# EAGLE design TESTED_Midi2PO_V3 (EAGLE 9.6.2)
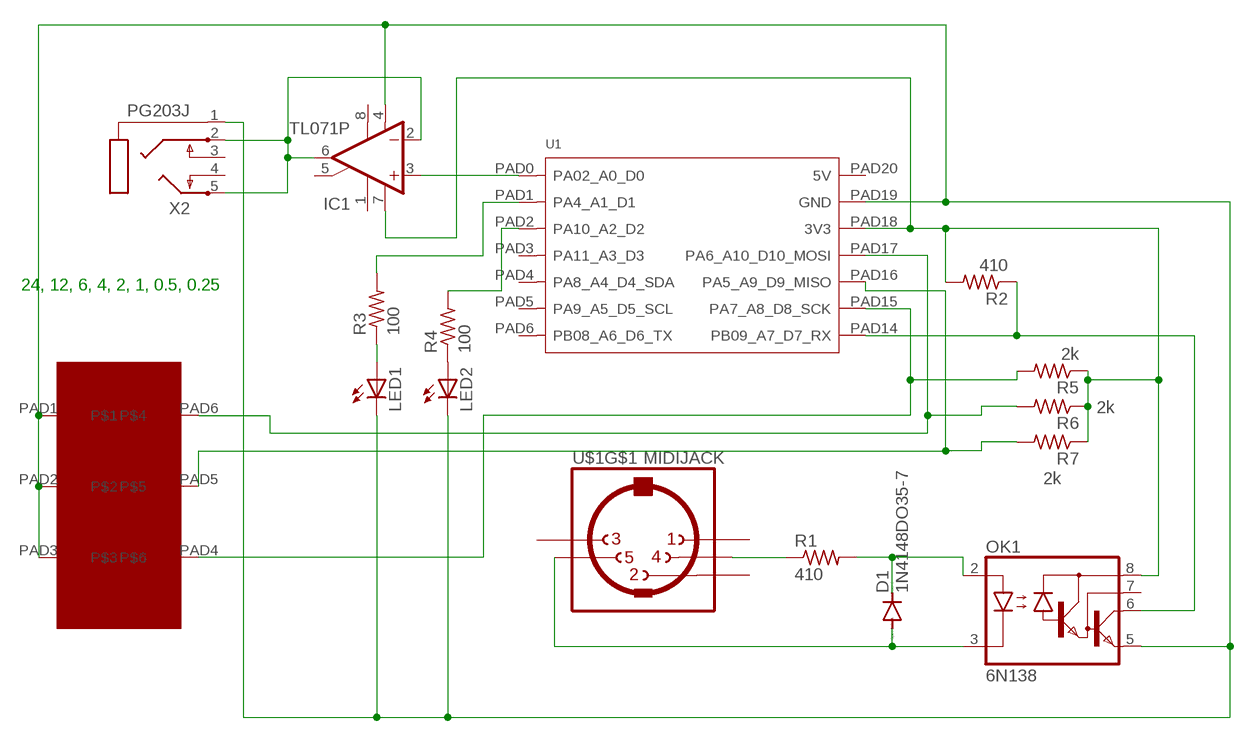
[diagram p0: schematic, sheet 1]

## Parts
D1  1N4148DO35-7  [DO35-7]
IC1  TL071P  [DIL08]
LED1  LED5MM  [LED5MM]
LED2  LED5MM  [LED5MM]
OK1  6N138  [DIL08]
R1  410  R-US_0207/9  [0207/9]
R2  410  R-US_0207/9  [0207/9]
R3  100  R-US_0207/9  [0207/9]
R4  100  R-US_0207/9  [0207/9]
R5  2k  R-US_0207/9  [0207/9]
R6  2k  R-US_0207/9  [0207/9]
R7  2k  R-US_0207/9  [0207/9]
U1  MOUDLE-SEEEDUINO-XIAO  [MOUDLE14P-2.54-21X17.8MM]
U$1  MIDIJACK  [CP-2350]
U$2  MCNDA-03V  [MCNDA-03V]
X2  PG203J  [PG203J]

## Nets
N$1: D1.C OK1.2(A) R1.2
N$2: R1.1 U$1.4
N$3: D1.A OK1.3(C) U$1.5
N$4: IC1.4(V-) LED1.K(C) LED2.K(C) OK1.5(GND) U1.PAD19(GND) U$2.PAD1 U$2.PAD2 U$2.PAD3 X2.1
N$5: OK1.6(VO) R2.1 U1.PAD14(PB09_A7_D7_RX)
N$6: R6.2 U1.PAD17(PA6_A10_D10_MOSI) U$2.PAD6
N$7: IC1.3(+IN) U1.PAD0(PA02_A0_D0)
N$8: LED1.A R3.1
N$9: R3.2 U1.PAD1(PA4_A1_D1)
N$11: IC1.2(-IN) IC1.6(OUT) X2.2 X2.5
N$12: LED2.A R4.1
N$13: R4.2 U1.PAD2(PA10_A2_D2)
N$14: R7.2 U1.PAD16(PA5_A9_D9_MISO) U$2.PAD5
N$15: R5.2 U1.PAD15(PA7_A8_D8_SCK) U$2.PAD4
N$16: IC1.7(V+) OK1.8(VCC) R2.2 R5.1 R6.1 R7.1 U1.PAD18(3V3)
Unconnected: IC1.1(ON1) IC1.5(ON2) IC1.8(OPT) OK1.7(VB) U1.PAD3(PA11_A3_D3) U1.PAD4(PA8_A4_D4_SDA) U1.PAD5(PA9_A5_D5_SCL) U1.PAD6(PB08_A6_D6_TX) U1.PAD20(5V) U$1.1 U$1.2 U$1.3 U$1.PE1(MT) U$1.PE2(MT) U$1.PE(MT) U$1.PE@(MT) X2.3 X2.4

## Notes on the sheet
- 24, 12, 6, 4, 2, 1, 0.5, 0.25

## Library data of the parts
D1 = diode:1N4148: DIODE high speed (Philips)
IC1 = linear:TL071: OP AMP
LED1 = adafruit:LED: LED OSRAM: - CHIPLED LG R971, LG N971, LY N971, LG Q971, LY Q971, LO R971, LY R971 LH N974, LH R974 LS Q976, LO Q976, LY Q976 LO Q996 - Hyper CHIPLED LW Q18S LB Q993, LB Q99A, LB R99A - SideLED LS A670, LO A670, LY A670, LG A670, LP A670 LB A673, LV A673, LT A673, LW A673 LH A674 LY A675 LS A676, LA A676, LO A676, LY A676, LW A676 LS A679, LY A679, LG A679 - Hyper Micro SIDELED® LS Y876, LA Y876, LO Y876, LY Y876 LT Y87S - SmartLED LW L88C, LW L88S LB L89C, LB L89S, LG L890 LS L89K, LO L89K, LY L89K LS L896, LA L896, LO L896, LY L896 - TOPLED LS T670, LO T670, LY T670, LG T670, LP T670 LSG T670, LSP T670, LSY T670, LOP T670, LYG T670 LG T671, LOG T671, LSG T671 LB T673, LV T673, LT T673, LW T673 LH T674 LS T676, LA T676, LO T676, LY T676, LB T676, LH T676, LSB T676, LW T676 LB T67C, LV T67C, LT T67C, LS T67K, LO T67K, LY T67K, LW E67C LS E67B, LA E67B, LO E67B, LY E67B, LB E67C, LV E67C, LT E67C LW T67C LS T679, LY T679, LG T679 LS T770, LO T770, LY T770, LG T770, LP T770 LB T773, LV T773, LT T773, LW T773 LH T774 LS E675, LA E675, LY E675, LS T675 LS T776, LA T776, LO T776, LY T776, LB T776 LHGB T686 LT T68C, LB T68C - Hyper Mini TOPLED® LB M676 - Mini TOPLED Santana® LG M470 LS M47K, LO M47K, LY M47K Source: http://www.osram.convergy.de/; SPICEPREFIX: L
LED2 = adafruit:LED: LED OSRAM: - CHIPLED LG R971, LG N971, LY N971, LG Q971, LY Q971, LO R971, LY R971 LH N974, LH R974 LS Q976, LO Q976, LY Q976 LO Q996 - Hyper CHIPLED LW Q18S LB Q993, LB Q99A, LB R99A - SideLED LS A670, LO A670, LY A670, LG A670, LP A670 LB A673, LV A673, LT A673, LW A673 LH A674 LY A675 LS A676, LA A676, LO A676, LY A676, LW A676 LS A679, LY A679, LG A679 - Hyper Micro SIDELED® LS Y876, LA Y876, LO Y876, LY Y876 LT Y87S - SmartLED LW L88C, LW L88S LB L89C, LB L89S, LG L890 LS L89K, LO L89K, LY L89K LS L896, LA L896, LO L896, LY L896 - TOPLED LS T670, LO T670, LY T670, LG T670, LP T670 LSG T670, LSP T670, LSY T670, LOP T670, LYG T670 LG T671, LOG T671, LSG T671 LB T673, LV T673, LT T673, LW T673 LH T674 LS T676, LA T676, LO T676, LY T676, LB T676, LH T676, LSB T676, LW T676 LB T67C, LV T67C, LT T67C, LS T67K, LO T67K, LY T67K, LW E67C LS E67B, LA E67B, LO E67B, LY E67B, LB E67C, LV E67C, LT E67C LW T67C LS T679, LY T679, LG T679 LS T770, LO T770, LY T770, LG T770, LP T770 LB T773, LV T773, LT T773, LW T773 LH T774 LS E675, LA E675, LY E675, LS T675 LS T776, LA T776, LO T776, LY T776, LB T776 LHGB T686 LT T68C, LB T68C - Hyper Mini TOPLED® LB M676 - Mini TOPLED Santana® LG M470 LS M47K, LO M47K, LY M47K Source: http://www.osram.convergy.de/
OK1 = optocoupler:6N138: MOTOROLA OPTO COUPLER; MF: VISHAY/TELEFUNKEN; MPN: 6N138; OC_FARNELL: 9860150; OC_NEWARK: 35K5294
R1 R2 R4-R7 = adafruit:R-US_: RESISTOR, American symbol
R3 = adafruit:R-US_: RESISTOR, American symbol; SPICEPREFIX: R
U1 = Seeeduino XIAO_holes:MOUDLE-SEEEDUINO-XIAO
U$1 = adafruit:MIDIJACK: DIN 5 jack also known as MIDI jack A modification of conn-hirshman:MAB5SH with two options for the grounding 'teeth'
U$2 = Vertical_DIP3_Sw:MCNDA-03V
X2 = con-hirschmann:PG203J: MIC/HEADPHONE JACK KS-S stereo microphone/headphone jack PG203JN (Schukat); OC_FARNELL: unknown; OC_NEWARK: unknown

## Board
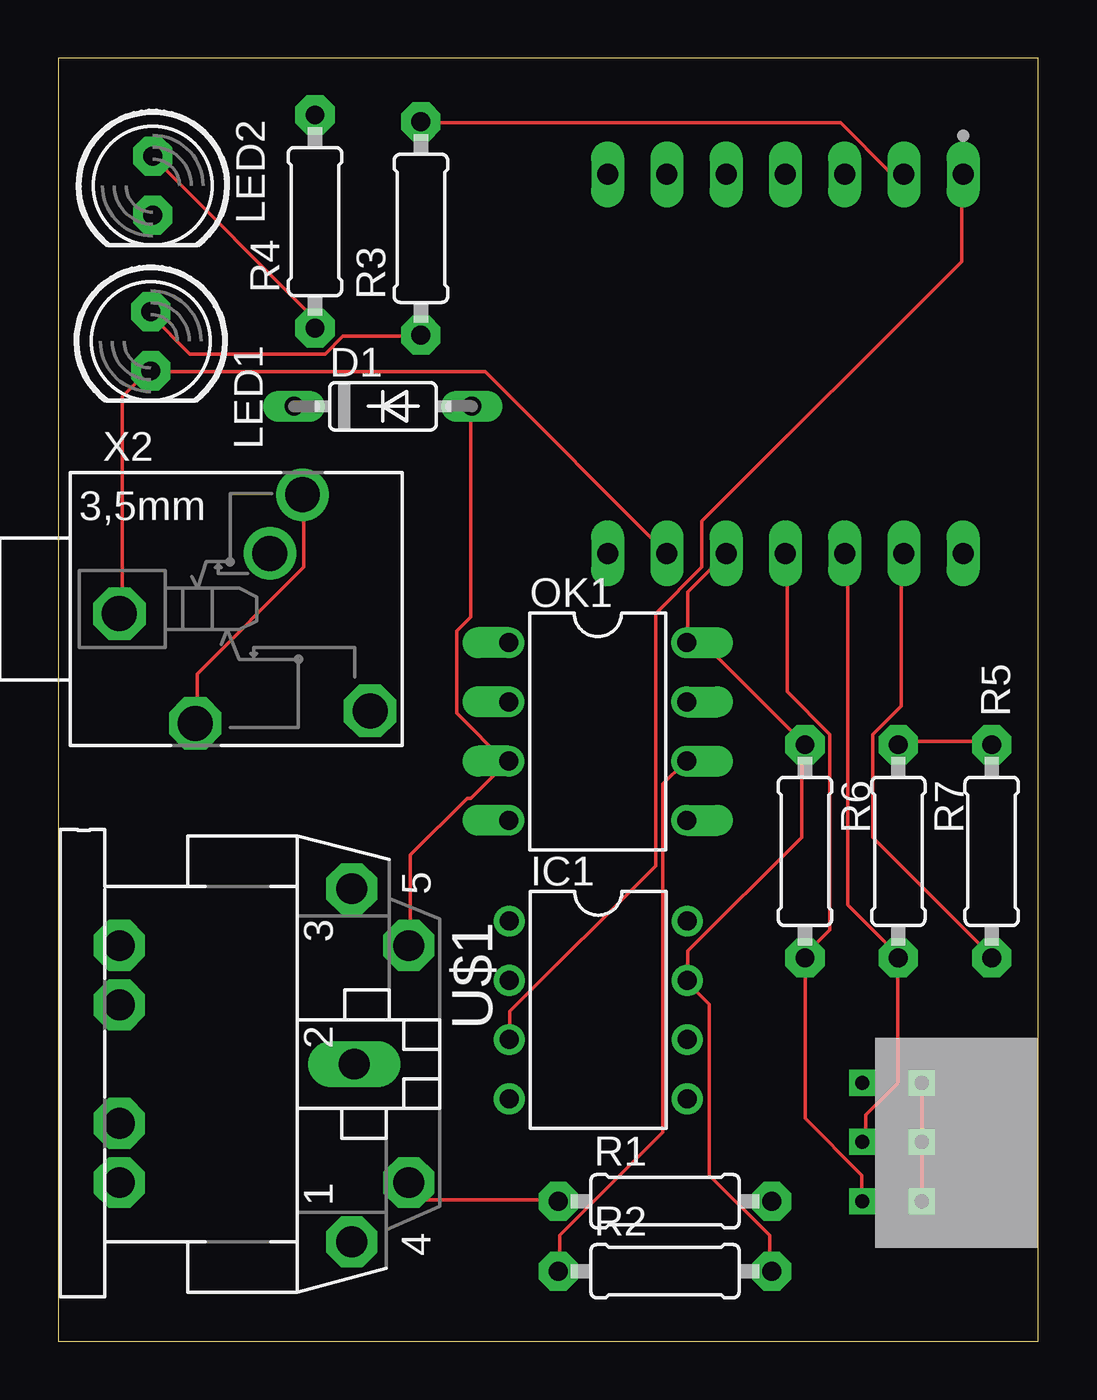
[diagram p1: board, top side]
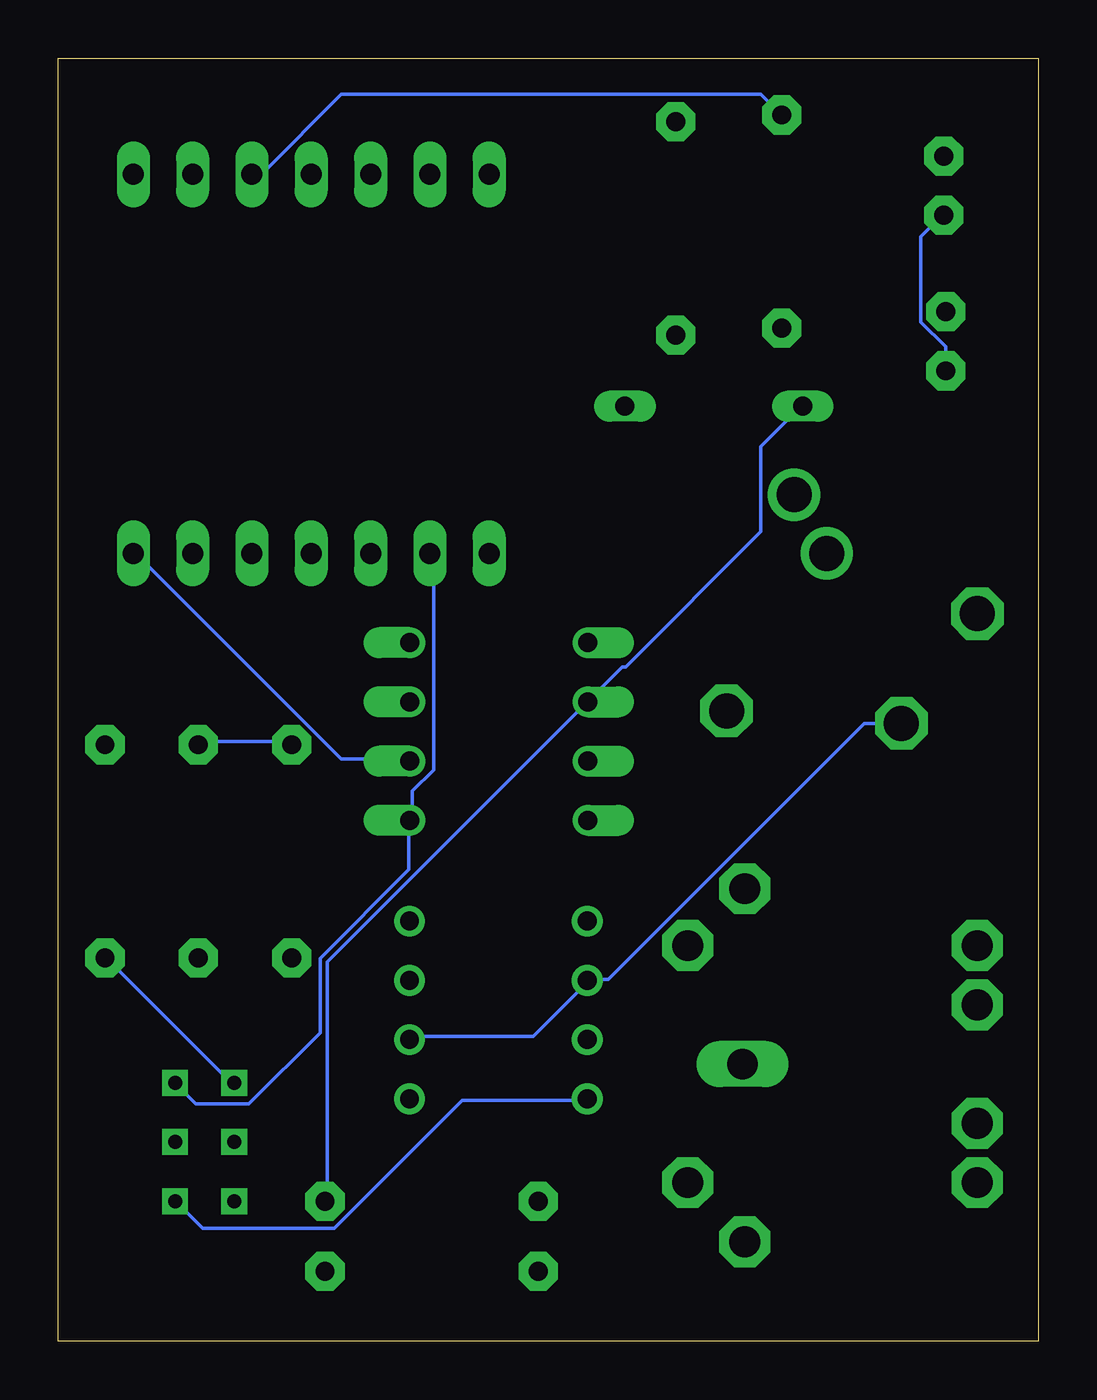
[diagram p2: board, bottom side, seen from below]

Size 42 x 55 mm. Coordinates in mm from the lower left corner, seen from the top.
Outline: 0,0 42,0 42,55 0,55 0,0
Copper layers (1*16): Top 0.035mm / dielectric 1.5mm / Bottom 0.035mm
Design rules "default": minimum track width 6mil, minimum drill 0.35mm, track to track 6mil, track to pad 6mil, pad to pad 6mil, via to via 6mil, smd to smd 6mil, copper to edge 40mil, drill to drill 6mil, minimum pad ring 10mil, minimum via ring 8mil, stop-mask expansion 4mil, vias tented up to drill 0mil, thermal gap 10mil

### Footprints (pad centres in the part's own frame; a part is rotated, then mirrored left to right if it is on the bottom)
DO35-7 = drill 0.813 long: A 3.81,0; C -3.81,0
DIL08 = drill 0.813 pad 1.27: 1 -3.81,-3.81; 2 -1.27,-3.81; 3 1.27,-3.81; 4 3.81,-3.81; 5 3.81,3.81; 6 1.27,3.81; 7 -1.27,3.81; 8 -3.81,3.81
LED5MM = drill 0.813 pad 1.676 octagon: A -1.27,0; K 1.27,0
DIL08' = drill 0.813 offset: 1 -3.81,-3.81; 2 -1.27,-3.81; 3 1.27,-3.81; 4 3.81,-3.81; 5 3.81,3.81; 6 1.27,3.81; 7 -1.27,3.81; 8 -3.81,3.81
0207/9 = drill 0.813 pad 1.676 octagon: 1 -4.572,0; 2 4.572,0
MOUDLE14P-2.54-21X17.8MM = drill 0.9 long: PAD0 0.762,18.161; PAD1 0.762,15.621; PAD2 0.762,13.081; PAD3 0.762,10.541; PAD4 0.762,8.001; PAD5 0.762,5.461; PAD6 0.762,2.921; PAD14 17.018,18.161; PAD15 17.018,15.621; PAD16 17.018,13.081; PAD17 17.018,10.541; PAD18 17.018,8.001; PAD19 17.018,5.461; PAD20 17.018,2.921
CP-2350 = drill 1.321 pad 2.184 octagon: 1 7.62,12.58; 3 -7.52,12.58; 4 5.08,15.02; 5 -5.08,15.02; PE -2.54,2.62; PE1 -5.08,2.62; PE2 5.08,2.62; PE@ 2.54,2.62 | drill 1.321 long: 2 0,12.68
MCNDA-03V = drill 0.6 square: PAD1 5,7; PAD2 5,4.46; PAD3 5,1.92; PAD4 7.54,1.92; PAD5 7.54,4.46; PAD6 7.54,7
PG203J = drill 1.499 octagon: 1 -5.004,-0.203; 4 5.74,-4.369; 5 -1.753,-4.902 | drill 1.499: 2 2.845,4.902; 3 1.448,2.388

### Placement (x,y rotation side)
D1  13.91,40.08 0 top
IC1  23.14,14.2 270 top
LED1  3.96,42.87 270 top
LED2  4.05,49.54 270 top
OK1  6N138  [DIL08']  23.12,26.14 270 top
R1  26,6 0 top
R2  26,3 0 top
R3  15.54,47.71 90 top
R4  11,48 90 top
R5  40,21 270 top
R6  32,21 270 top
R7  36,21 270 top
U1  20.62,50.79 270 top
U$1  0,11.88 270 top
U$2  42,13 180 top
X2  7.62,31.39 0 top

### Tracks (layer width: path | path; a pad name or v marks a point on that pad's centre or on a via)
N$1
  Bottom 0.152: D1.C 10.21,40.04 11.89,38.36 11.89,34.7 17.68,28.91 17.83,28.91 19.2,27.54 OK1.2 19.36,27.39 30.48,16.27 30.48,6.05 R1.2
N$2
  Top 0.152: R1.1 21.34,6.05 15.7,6.05 15.09,6.66 U$1.4
N$3
  Top 0.152: 19.2,24.8 17.68,23.28 17.53,23.28 15.09,20.84 15.09,17.03 U$1.5 | 19.2,24.8 17.07,26.93 17.07,30.44 17.68,31.05 17.68,40.04 D1.A | 19.2,24.8 OK1.3
N$4
  Top 0.152: X2.1 2.74,31.2 2.74,40.5 3.81,41.56 LED1.K 3.96,41.56 18.29,41.56 26.06,33.79 U1.PAD19 | U$2.PAD1 37.03,6.05 37.03,8.49 U$2.PAD2 37.03,8.65 37.03,10.93 U$2.PAD3
  Bottom 0.152: LED1.K 3.96,41.72 3.96,42.63 5.03,43.7 5.03,47.35 4.12,48.27 LED2.K | U1.PAD19 26.06,33.64 25.91,33.49 25.91,24.49 26.82,23.58 26.82,22.36 OK1.5 26.98,22.21 26.98,20.23 30.79,16.42 30.79,13.22 33.83,10.17 36.12,10.17 36.88,10.93 U$2.PAD3 | IC1.4 19.36,10.32 24.69,10.32 30.18,4.84 35.81,4.84 36.88,5.9 U$2.PAD1
N$5
  Top 0.152: R2.1 21.49,3.01 21.49,4.53 25.91,8.95 25.91,23.89 26.82,24.8 OK1.6
  Bottom 0.152: OK1.6 26.98,24.95 29.87,24.95 38.71,33.79 U1.PAD14
N$6
  Top 0.152: U$2.PAD6 34.44,6.05 34.44,7.12 32,9.56 32,16.42 R6.2 32,16.57 33.07,17.64 33.07,26.02 31.24,27.85 31.24,33.64 U1.PAD17
N$7
  Top 0.152: IC1.3 19.36,13.06 19.36,14.13 25.6,20.38 25.6,31.2 27.58,33.18 27.58,35.16 38.71,46.29 38.71,49.94 U1.PAD0
N$8
  Top 0.152: R3.1 15.39,43.09 12.19,43.09 11.43,42.33 5.64,42.33 3.96,44 LED1.A
N$9
  Top 0.152: U1.PAD1 36.12,50.1 35.66,50.1 33.53,52.23 15.54,52.23 R3.2
N$11
  Top 0.152: X2.5 5.94,26.63 5.94,28.61 10.52,33.18 10.52,36.23 X2.2
  Bottom 0.152: IC1.6 26.82,13.06 21.64,13.06 19.36,15.35 IC1.2 19.2,15.5 18.44,15.5 7.47,26.48 5.94,26.48 X2.5
N$12
  Top 0.152: R4.1 10.97,43.54 10.97,43.85 4.12,50.71 LED2.A
N$13
  Bottom 0.152: U1.PAD2 33.68,50.1 33.22,50.1 29.87,53.45 11.89,53.45 11.12,52.69 R4.2
N$14
  Top 0.152: U$2.PAD5 34.59,8.65 34.59,9.71 35.97,11.08 35.97,16.42 R7.2 35.97,16.57 33.83,18.7 33.83,33.64 U1.PAD16
N$15
  Top 0.152: U1.PAD15 36.12,33.64 36.12,27.24 34.9,26.02 34.9,21.6 39.93,16.57 R5.2
  Bottom 0.152: U$2.PAD4 34.59,11.08 39.93,16.42 R5.2
N$16
  Top 0.152: R7.1 36.12,25.71 39.93,25.71 R5.1 | U1.PAD18 28.5,33.64 26.98,32.11 26.98,29.98 OK1.8 26.98,29.83 27.74,29.83 31.85,25.71 R6.1 31.85,25.56 31.85,21.6 26.98,16.72 26.98,15.5 IC1.7 26.98,15.35 27.89,14.44 27.89,7.12 30.48,4.53 30.48,3.01 R2.2
  Bottom 0.152: R7.1 35.97,25.71 32,25.71 R6.1